# EAGLE design SparkFun_Pi_AVR_Programmer_ADAPTER (EAGLE 7.6.0)
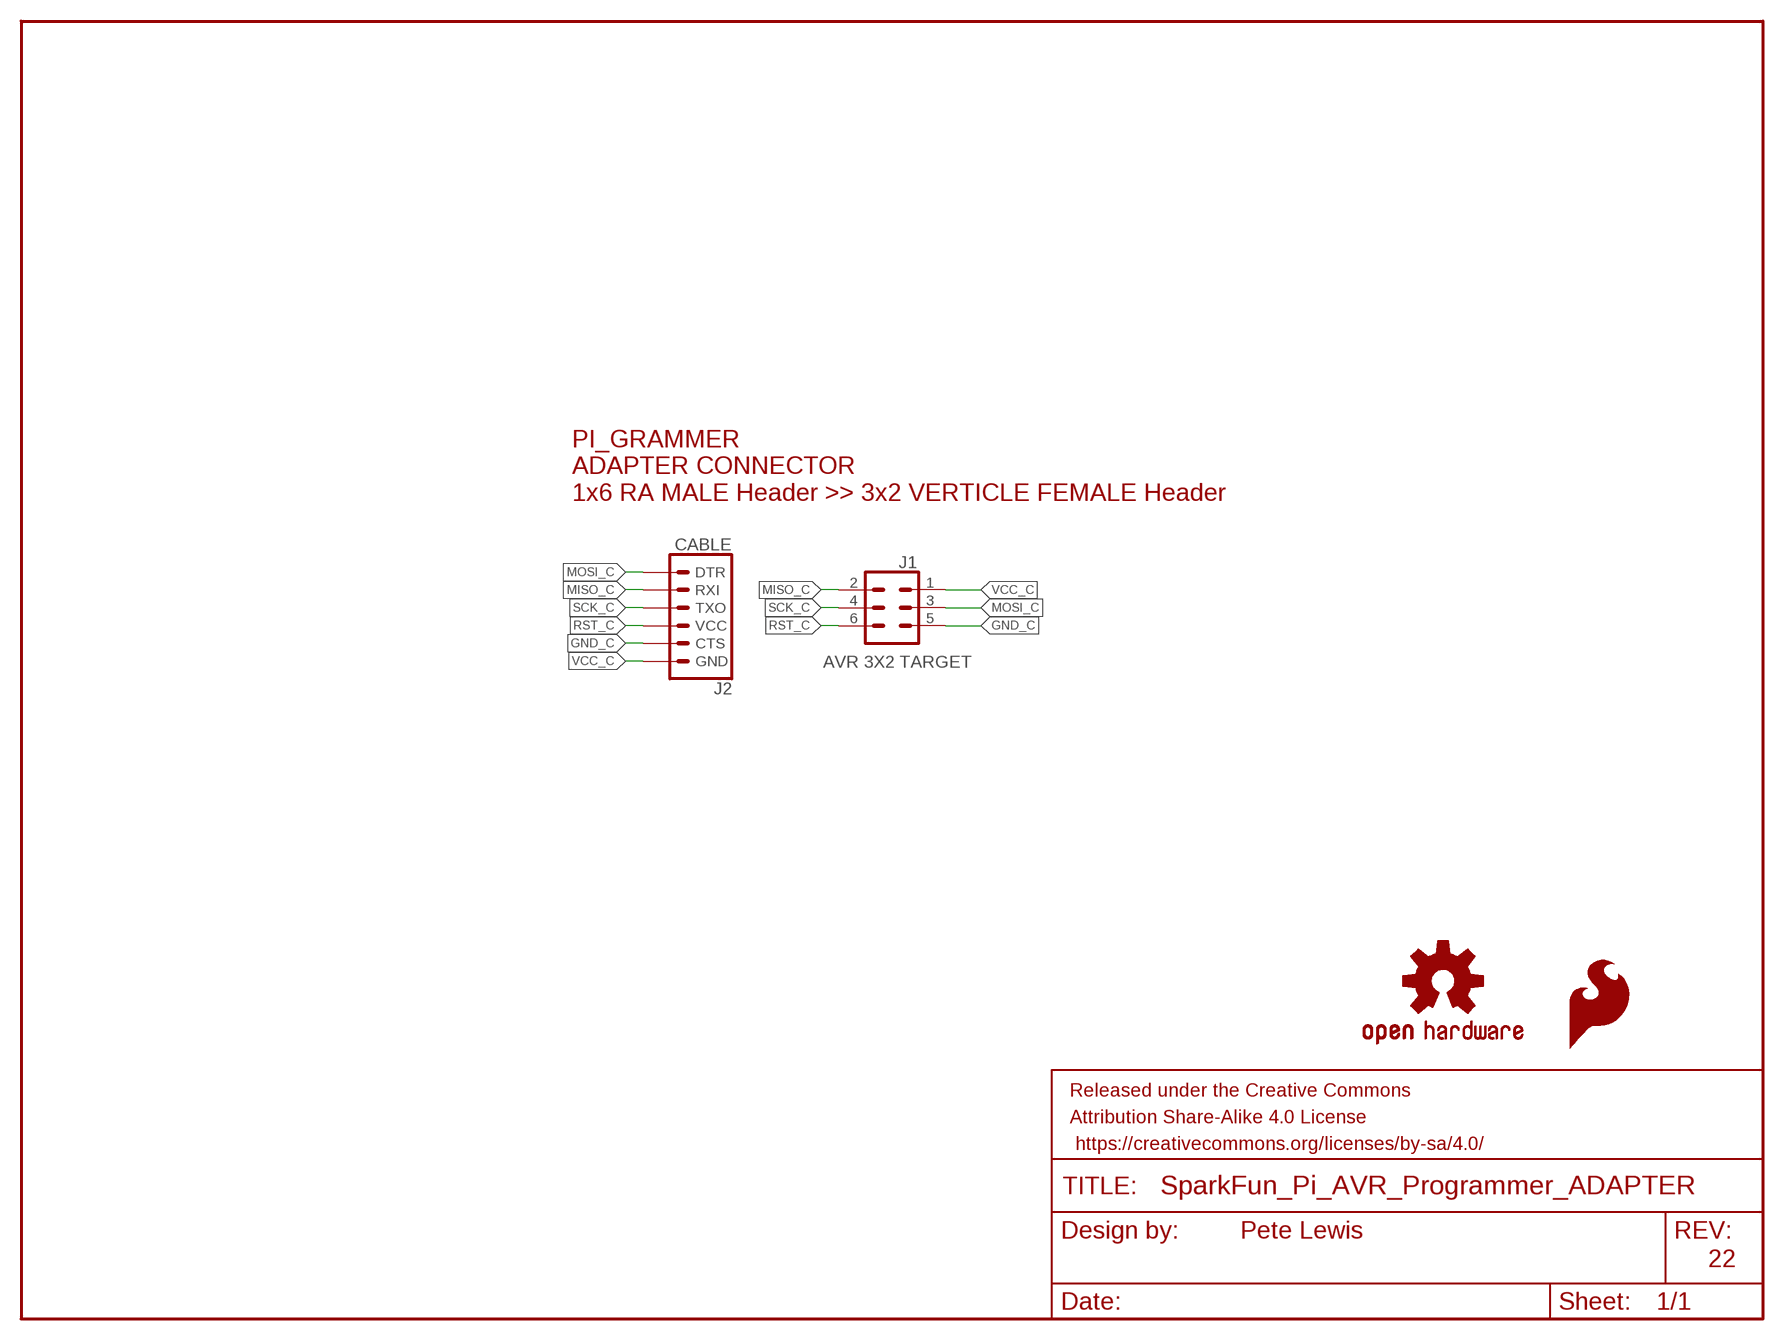
[diagram p0: schematic, sheet 1]

## Parts
FRAME1  FRAME-LETTER  [CREATIVE_COMMONS]
J1  AVR 3X2 TARGET  CONN_03X2SMT  [2X3_SMT_POSTS]
J2  CABLE  6_PIN_SERIAL_TARGETSMD  [1X06-SMD_RA_MALE]
LOGO1  SFE_LOGO_FLAME.1_INCH  [SFE_LOGO_FLAME_.1]
LOGO2  OSHW-LOGOMINI  [OSHW-LOGO-MINI]

## Nets
GND_C: J1.5 J2.5(CTS)
MISO_C: J1.2 J2.2(RXI)
MOSI_C: J1.3 J2.1(DTR)
RST_C: J1.6 J2.4(VCC)
SCK_C: J1.4 J2.3(TXO)
VCC_C: J1.1 J2.6(GND)

## Notes on the sheet
- PI_GRAMMER
  ADAPTER CONNECTOR
  1x6 RA MALE Header >> 3x2 VERTICLE FEMALE Header
- Pete Lewis
- 22

## Library data of the parts
FRAME1 = SparkFun-Aesthetics:FRAME-LETTER: Schematic Frame - Letter Standard 8.5x11 US Letter frame
J1 = SparkFun-Connectors:CONN_03X2: Multi connection point. Often used as Generic Header-pin footprint for 0.1 inch spaced/style header connections You can populate with any combo of single row headers, but if you'd like an exact match, check these: Header - 2x3 (Male, 0.1") <https://www.sparkfun.com/products/12807> (PRT-12807) Header - 2x3 (Female, 0.1") <https://www.sparkfun.com/products/13010> (PRT-13010) 2x3 Pin Shrouded Header <https://www.sparkfun.com/products/10877> (PRT-10877) On any of the 0.1 inch spaced packages, you can populate with these: Break Away Headers - Straight <https://www.sparkfun.com/products/116> (PRT-00116) Break Away Male Headers - Right Angle <https://www.sparkfun.com/products/553> (PRT-00553) Female Headers <https://www.sparkfun.com/products/115> (PRT-00115) Break Away Headers - Machine Pin <https://www.sparkfun.com/products/117> (PRT-00117) Break Away Female Headers - Swiss Machine Pin <https://www.sparkfun.com/products/743> (PRT-00743) Special note: the shrouded connector mates well with our 3x2 ribbon cables: Ribbon Crimp Connector - 6-pin (2x3, Female) <https://www.sparkfun.com/products/10651> (PRT-10651) Ribbon Cable - 6 wire (15ft) <https://www.sparkfun.com/products/10646> (PRT-10646); PROD_ID: CONN-11415
J2 = SparkFun-Connectors:6_PIN_SERIAL_TARGET: 6-pin header connection for use with the "FTDI BASIC" pinout - TARGET SIDE. Also known as "Arduino Serial Program Header". It is used to mate with our FTDI Basic serial programmers using the Arduino IDE. Note, this device has "TARGET" in the name. It is intended to be used on a design that contains a target micro-controller that you wish to program. The "sister" device, named "CABLE" is inteneded to be used on a design that usually lives on the end of your USB cable and prvides the converter chip (FTDI232 or FTDI231x) to commnicate serial RX/TX. You can populate with some of these: Break Away Headers - Straight <https://www.sparkfun.com/products/116> (PRT-00116) For reference (or to suit your programming needs) check out these designs: SparkFun FTDI Basic Breakout - 5V <https://www.sparkfun.com/products/9716> (DEV-09716) SparkFun FTDI Basic Breakout - 3.3V <https://www.sparkfun.com/products/9873> (DEV-09873) SparkFun FTDI SmartBasic <https://www.sparkfun.com/products/12935> (DEV-12935) SparkFun Beefy 3 - FTDI Basic Breakout <https://www.sparkfun.com/products/13746> (DEV-13746); PROD_ID: CONN-10140
LOGO1 = SparkFun-Aesthetics:SFE_LOGO_FLAME: SparkFun Flame Logo This is the SparkFun flame logo. The logo on the schematic will always be the same size; the package variant is the height of the flame. Default layer for the logo on the board is tSilk.
LOGO2 = SparkFun-Aesthetics:OSHW-LOGO: Open-Source Hardware (OSHW) Logo This logo indicates the piece of hardware it is found on incorporates a OSHW license and/or adheres to the definition of open source hardware found here: http://freedomdefined.org/OSHW

## Board
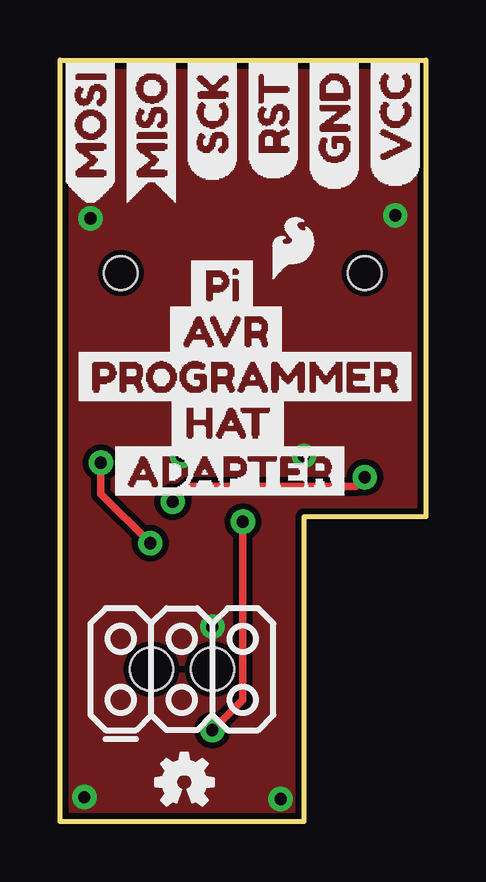
[diagram p1: board, top side]
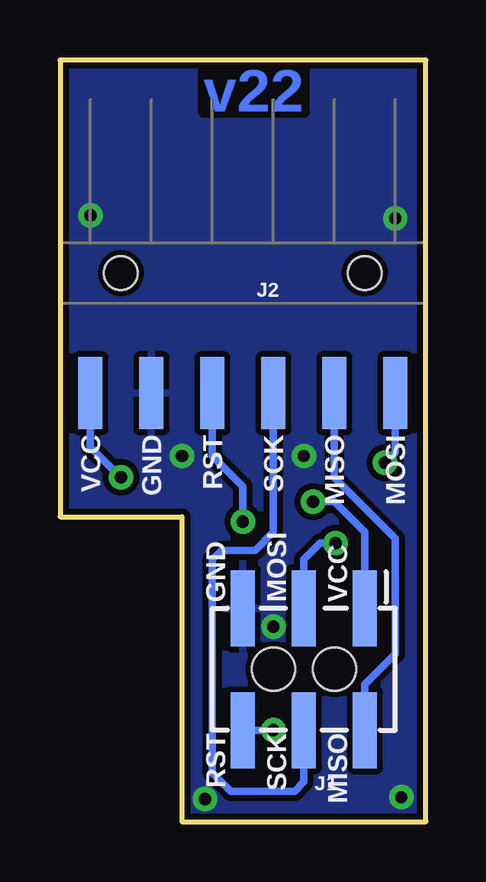
[diagram p2: board, bottom side, seen from below]

Size 15.24 x 31.75 mm. Coordinates in mm from the lower left corner, seen from the top.
Outline: 10.16,0 0,0 0,31.75 15.24,31.75 15.24,12.7 10.16,12.7 10.16,0
Copper layers (1*16): Top 0.035mm / dielectric 1.5mm / Bottom 0.035mm
Design rules "SparkFun-2-layer-STANDARD": minimum track width 10mil, minimum drill 20mil, track to track 10mil, track to pad 8mil, pad to pad 8mil, via to via 10mil, smd to smd 8mil, copper to edge 8mil, drill to drill 8mil, minimum pad ring 10mil, minimum via ring 10mil, stop-mask expansion 4mil, vias tented up to drill 25mil, thermal gap 10mil

### Footprints (pad centres in the part's own frame; a part is rotated, then mirrored left to right if it is on the bottom)
2X3_SMT_POSTS = smd 1 x 3.17: 1 -2.54,-2.54; 2 -2.54,2.54; 3 0,-2.54; 4 0,2.54; 5 2.54,-2.54; 6 2.54,2.54 | hole 1.8: -1.27,0; 1.27,0
1X06-SMD_RA_MALE = smd 1 x 3: 1 -6.35,5; 2 -3.81,5; 3 -1.27,5; 4 1.27,5; 5 3.81,5; 6 6.35,5 | hole 1.4: -5.08,0; 5.08,0

### Placement (x,y rotation side)
FRAME1  -21.59,-12.7 0 top  (outside the outline)
J1  5.08,6.35 180 bottom
J2  7.62,22.86 180 bottom
LOGO1  8.56,22.28 0 top
LOGO2  5.18,1.65 0 top
U$1  [GND1]  11.43,26.29 90 top
U$2  [MISO5]  3.81,25.65 90 top
U$3  [MOSI4]  1.27,25.65 90 top
U$4  [RST2]  8.89,26.67 90 top
U$5  [SCK3]  6.35,26.67 90 top
U$6  [VCC0]  13.97,26.42 90 top
U$7  [PI0]  4.83,22.35 0 top
U$8  [AVR1]  3.94,20.45 0 top
U$9  [PROGRAMMER2]  0.13,18.54 0 top
U$10  [HAT3]  4.06,16.64 0 top
U$11  [ADAPTER4]  1.65,14.61 0 top

### Tracks (layer width: path | path; a pad name or v marks a point on that pad's centre or on a via)
GND_C  (via drill 0.51)
  other vias: 13.97,25.27 1.27,25.15 6.35,8.13 5.08,15.24 10.16,15.24 9.19,0.94 1.02,1.02
  pour Bottom (isolate 0.254): 15.24,0 0,0 0,31.75 15.24,31.75
  pour Top (isolate 0.254): 15.24,0 0,0 0,31.75 15.24,31.75
MISO_C
  Bottom 0.305: J2.2 3.81,14.35 1.27,11.81 1.27,6.99 2.54,5.71 J1.2
MOSI_C  (via drill 0.51)
  Top 0.305: v3.76,11.61 1.7,13.66 v1.7,14.96
  Bottom 0.305: J1.3 5.08,10.92 4.39,11.61 v3.76,11.61 | J2.1 1.27,15.39 v1.7,14.96
RST_C  (via drill 0.51)
  Top 0.305: v6.35,3.81 7.62,5.08 v7.62,12.5
  Bottom 0.305: J1.6 v6.35,3.81 | v7.62,12.5 7.62,13.97 8.89,15.24 J2.4
SCK_C
  Bottom 0.305: J2.3 6.35,12.06 7.11,11.3 8.51,11.3 8.89,10.92 8.89,2.03 8.13,1.27 5.46,1.27 5.08,1.65 J1.4
VCC_C  (via drill 0.51)
  Top 0.305: v12.7,14.35 12.32,13.97 5.33,13.97 v4.7,13.34
  Bottom 0.305: J1.1 2.54,12.06 3.81,13.34 v4.7,13.34 | v12.7,14.35 13.97,15.62 J2.6

### Text on the board
Bottom: v22
bPlace: MOSI | MISO | SCK | RST | GND | VCC | VCC | MOSI | GND | MISO | SCK | RST
tDocu: Pete Lewis